# EAGLE design OSO-PYCO-A1-01 (EAGLE 9.6.2)
CHECKED: KTOWN; COMPANY: ADAFRUIT INDUSTRIES; DRAWN: KTOWN; REV: A

## Sheet 1 of 2
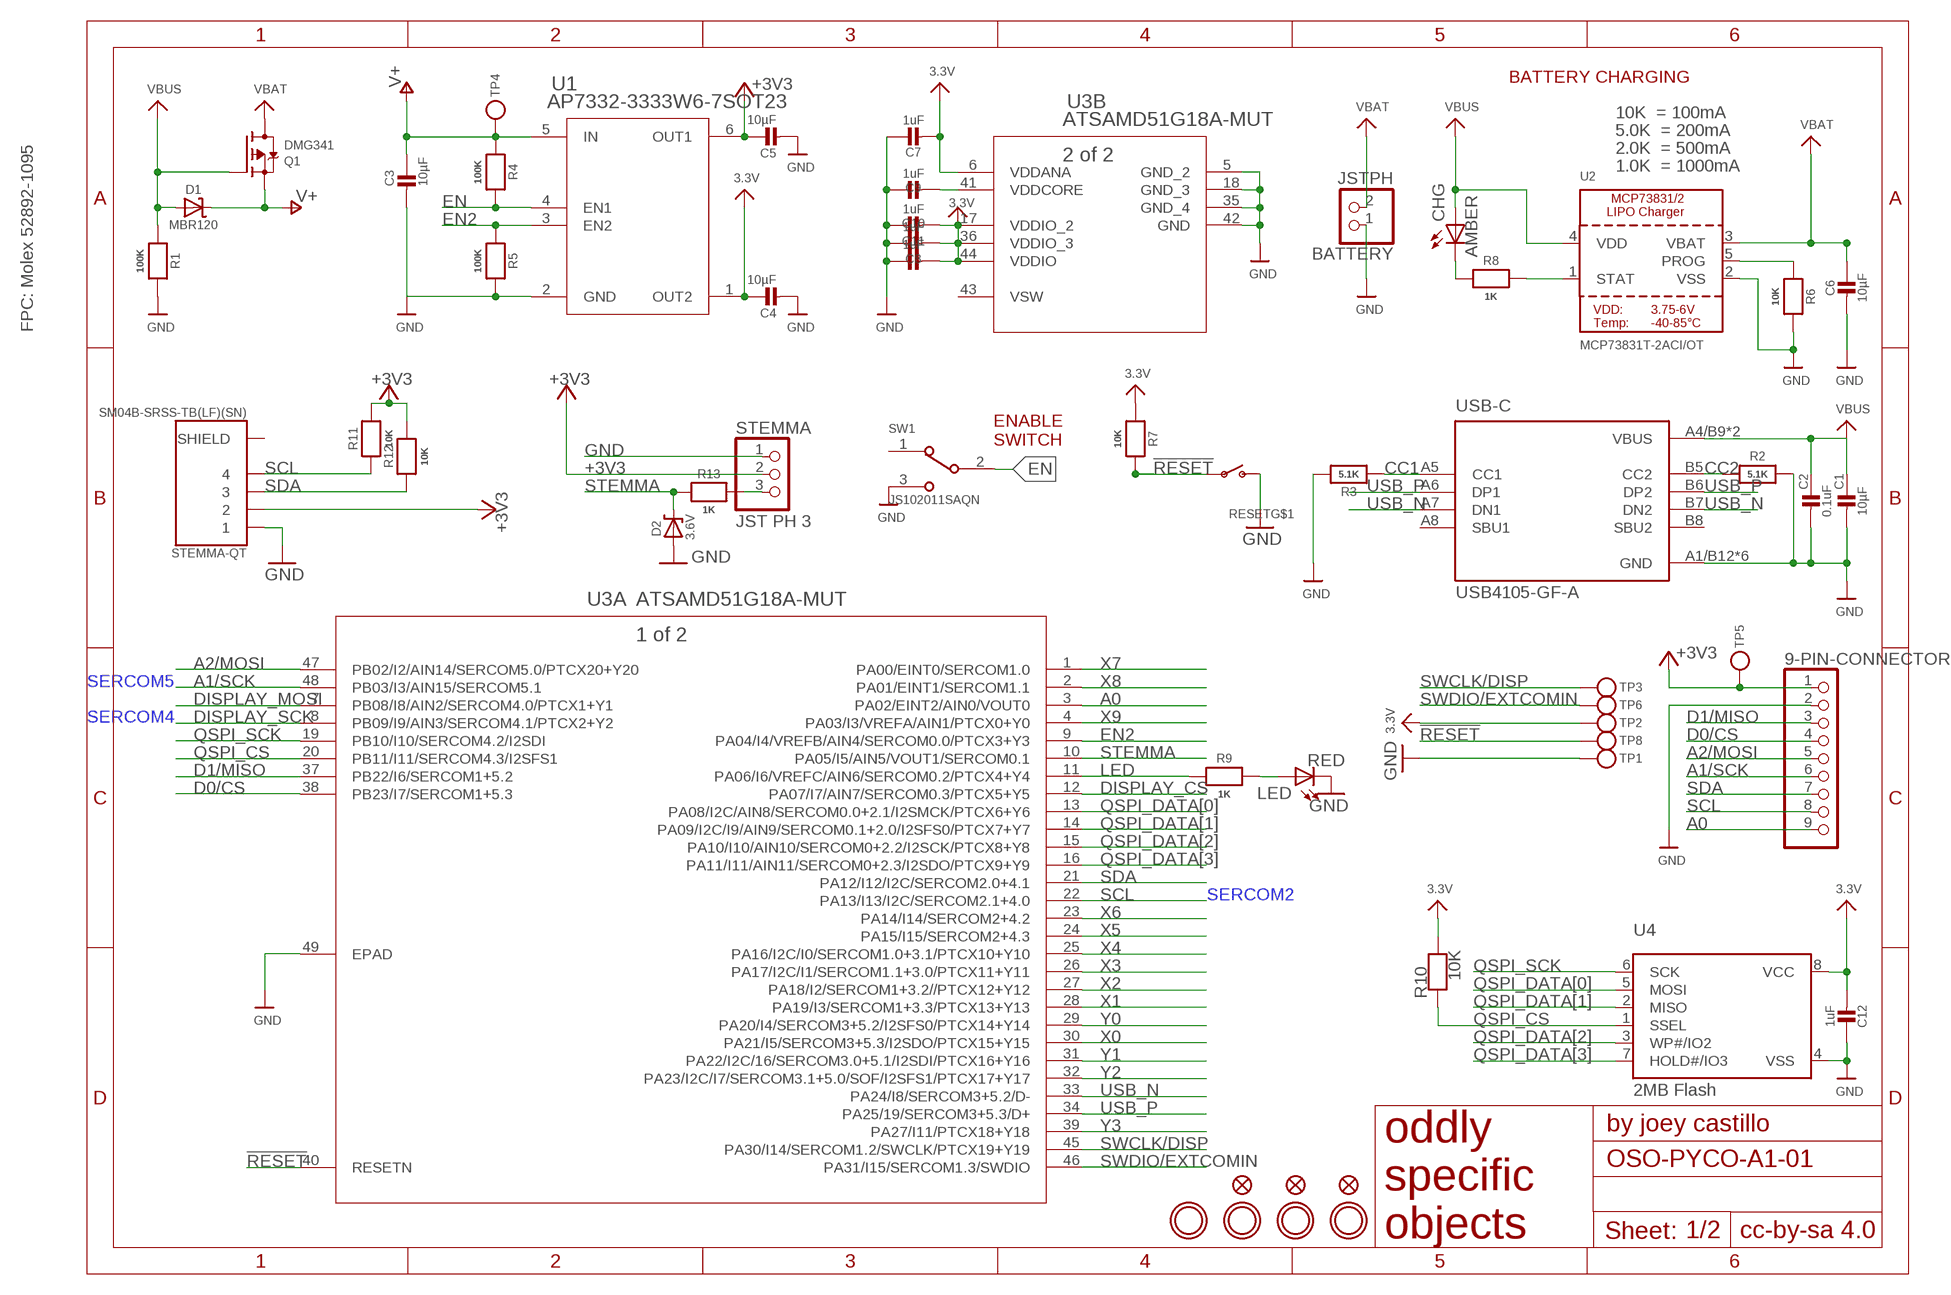
[diagram p0: schematic, sheet 1]

### Parts
9-PIN-CONNECTOR  HEADER-1X9_JSTSH  [JST_SH9]
BATTERY  JSTPH  CON_JST_PH_2PIN  [JSTPH2]
C1  10µF  CAP_CERAMIC0805-NOOUTLINE  [0805-NO]
C2  0.1uF  CAP_CERAMIC_0603MP  [_0603MP]
C3  10µF  CAP_CERAMIC0805-NOOUTLINE  [0805-NO]
C4  10µF  CAP_CERAMIC0805-NOOUTLINE  [0805-NO]
C5  10µF  CAP_CERAMIC0805-NOOUTLINE  [0805-NO]
C6  10µF  CAP_CERAMIC0805-NOOUTLINE  [0805-NO]
C7  1uF  CAP_CERAMIC_0603MP  [_0603MP]
C8  1uF  CAP_CERAMIC_0603MP  [_0603MP]
C9  1uF  CAP_CERAMIC_0603MP  [_0603MP]
C10  1uF  CAP_CERAMIC_0603MP  [_0603MP]
C11  1uF  CAP_CERAMIC_0603MP  [_0603MP]
C12  1uF  CAP_CERAMIC_0603MP  [_0603MP]
CHG  AMBER  LEDCHIP-LED0805  [CHIP-LED0805]
D1  MBR120  DIODE-SCHOTTKYSOD-123  [SOD-123]
D2  3.6V  DIODE-ZENERSOD123  [SOD-123]
FID1  FIDUCIAL_1MM  [FIDUCIAL_1MM]
FID2  FIDUCIAL_1MM  [FIDUCIAL_1MM]
FID3  FIDUCIAL_1MM  [FIDUCIAL_1MM]
LED  RED  LEDCHIP-LED0805  [CHIP-LED0805]
Q1  DMG341  MOSFET-P  [SOT23-R]
R1  100K  RESISTOR_0603MP  [_0603MP]
R2  5.1K  RESISTOR_0603MP  [_0603MP]
R3  5.1K  RESISTOR_0603MP  [_0603MP]
R4  100K  RESISTOR_0603MP  [_0603MP]
R5  100K  RESISTOR_0603MP  [_0603MP]
R6  10K  RESISTOR_0603MP  [_0603MP]
R7  10K  RESISTOR_0603MP  [_0603MP]
R8  1K  RESISTOR_0603MP  [_0603MP]
R9  1K  RESISTOR_0603MP  [_0603MP]
R10  10K  RESISTOR_0603MP  [_0603MP]
R11  10K  RESISTOR_0603MP  [_0603MP]
R12  10K  RESISTOR_0603MP  [_0603MP]
R13  1K  RESISTOR_0603MP  [_0603MP]
RESET  SWITCH_SPSTTL3330A  [TL3330A]
STEMMA  JST PH 3  CON_JST_PH_3PIN  [JSTPH3]
STEMMA-QT  SM04B-SRSS-TB(LF)(SN)  [JST_SM04B-SRSS-TB(LF)(SN)]
SW1  JS102011SAQN  [SW_JS102011SAQN]
TP1  TESTPOINTROUND2MMNO  [TESTPOINT_ROUND_2MM_NO]
TP2  TESTPOINTROUND2MMNO  [TESTPOINT_ROUND_2MM_NO]
TP3  TESTPOINTROUND2MMNO  [TESTPOINT_ROUND_2MM_NO]
TP4  TESTPOINTROUND2MMNO  [TESTPOINT_ROUND_2MM_NO]
TP5  TESTPOINTROUND2MMNO  [TESTPOINT_ROUND_2MM_NO]
TP6  TESTPOINTROUND2MMNO  [TESTPOINT_ROUND_2MM_NO]
TP8  TESTPOINTROUND2MMNO  [TESTPOINT_ROUND_2MM_NO]
U1  AP7332-3333W6-7SOT23  [SOT23-6]
U2  MCP73831T-2ACI/OT  MCP73831/2  [SOT23-5]
U3  ATSAMD51G18A-MUT  [QFN48_7X7MC]
U4  2MB Flash  SPIFLASH_SOIC8  [SOIC8_150MIL]
U$9  MOUNTINGHOLE2.5  [MOUNTINGHOLE_2.5_PLATED]
U$10  MOUNTINGHOLE2.5  [MOUNTINGHOLE_2.5_PLATED]
U$27  MOUNTINGHOLE2.5  [MOUNTINGHOLE_2.5_PLATED]
U$28  MOUNTINGHOLE2.5  [MOUNTINGHOLE_2.5_PLATED]
USB-C  USB4105-GF-A  [GCT_USB4105-GF-A]

### Nets
3.3V [power]: C4.1 C7.2 C8.2 C10.2 C11.2 C12.2 R7.1 R10.2 TP2.P$1 U1.1(OUT2) U3.6(B:VDDANA) U3.17(B:VDDIO_2) U3.36(B:VDDIO_3) U3.44(B:VDDIO) U4.8(VCC) ; also sheet 2
!RESET: R7.2 RESET.P$1(P) TP8.P$1 U3.40(A:RESETN)
+3V3 [power]: 9-PIN-CONNECTOR.1 C5.1 R11.2 R12.2 STEMMA-QT.2 STEMMA.2 TP5.P$1 U1.6(OUT1)
A0: 9-PIN-CONNECTOR.9 U3.3(A:PA02/EINT2/AIN0/VOUT0)
A1/SCK: 9-PIN-CONNECTOR.6 U3.48(A:PB03/I3/AIN15/SERCOM5.1)
A2/MOSI: 9-PIN-CONNECTOR.5 U3.47(A:PB02/I2/AIN14/SERCOM5.0/PTCX20+Y20)
CC1: R3.1 USB-C.A5(CC1)
CC2: R2.1 USB-C.B5(CC2)
D0/CS: 9-PIN-CONNECTOR.4 U3.38(A:PB23/I7/SERCOM1+5.3)
D1/MISO: 9-PIN-CONNECTOR.3 U3.37(A:PB22/I6/SERCOM1+5.2)
DISPLAY_CS: U3.12(A:PA07/I7/AIN7/SERCOM0.3/PTCX5+Y5) ; also sheet 2
DISPLAY_MOSI: U3.7(A:PB08/I8/AIN2/SERCOM4.0/PTCX1+Y1) ; also sheet 2
DISPLAY_SCK: U3.8(A:PB09/I9/AIN3/SERCOM4.1/PTCX2+Y2) ; also sheet 2
EN: R4.2 SW1.2 U1.4(EN1) ; also sheet 2
EN2: R5.1 U1.3(EN2) U3.9(A:PA04/I4/VREFB/AIN4/SERCOM0.0/PTCX3+Y3)
GND [gnd]: 9-PIN-CONNECTOR.2 BATTERY.1 C1.2 C2.2 C3.2 C4.2 C5.2 C6.2 C7.1 C8.1 C9.1 C10.1 C11.1 C12.1 D2.A LED.C R1.2 R2.2 R3.2 R5.2 R6.2 RESET.P$2(S) STEMMA-QT.1 STEMMA.1 SW1.3 TP1.P$1 U1.2(GND) U2.2(VSS) U3.5(B:GND_2) U3.18(B:GND_3) U3.35(B:GND_4) U3.42(B:GND) U3.49(A:EPAD) U4.4(VSS) USB-C.A1/B12(GND) USB-C.B1/A12(GND) USB-C.G1(GND) USB-C.G2(GND) USB-C.G3(GND) USB-C.G4(GND) ; also sheet 2
LED: R9.1 U3.11(A:PA06/I6/VREFC/AIN6/SERCOM0.2/PTCX4+Y4)
N$1: LED.A R9.2
N$2: CHG.C R8.1
PROG: R6.1 U2.5(PROG)
QSPI_CS: R10.1 U3.20(A:PB11/I11/SERCOM4.3/I2SFS1) U4.1(SSEL)
QSPI_DATA[0]: U3.13(A:PA08/I2C/AIN8/SERCOM0.0+2.1/I2SMCK/PTCX6+Y6) U4.5(MOSI)
QSPI_DATA[1]: U3.14(A:PA09/I2C/I9/AIN9/SERCOM0.1+2.0/I2SFS0/PTCX7+Y7) U4.2(MISO)
QSPI_DATA[2]: U3.15(A:PA10/I10/AIN10/SERCOM0+2.2/I2SCK/PTCX8+Y8) U4.3(WP#/IO2)
QSPI_DATA[3]: U3.16(A:PA11/I11/AIN11/SERCOM0+2.3/I2SDO/PTCX9+Y9) U4.7(HOLD#/IO3)
QSPI_SCK: U3.19(A:PB10/I10/SERCOM4.2/I2SDI) U4.6(SCK)
SCL: 9-PIN-CONNECTOR.8 R11.1 STEMMA-QT.4 U3.22(A:PA13/I13/I2C/SERCOM2.1+4.0)
SDA: 9-PIN-CONNECTOR.7 R12.1 STEMMA-QT.3 U3.21(A:PA12/I12/I2C/SERCOM2.0+4.1)
STAT: R8.2 U2.1(STAT)
STEMMA: D2.C R13.2 U3.10(A:PA05/I5/AIN5/VOUT1/SERCOM0.1)
STEMMA_: R13.1 STEMMA.3
SWCLK/DISP: TP3.P$1 U3.45(A:PA30/I14/SERCOM1.2/SWCLK/PTCX19+Y19) ; also sheet 2
SWDIO/EXTCOMIN: TP6.P$1 U3.46(A:PA31/I15/SERCOM1.3/SWDIO) ; also sheet 2
USB_N: U3.33(A:PA24/I8/SERCOM3+5.2/D-) USB-C.A7(DN1) USB-C.B7(DN2)
USB_P: U3.34(A:PA25/19/SERCOM3+5.3/D+) USB-C.A6(DP1) USB-C.B6(DP2)
V+ [power]: C3.1 D1.C Q1.2(S) R4.1 TP4.P$1 U1.5(IN) ; also sheet 2
VBAT [power]: BATTERY.2 C6.1 Q1.3(D) U2.3(VBAT)
VBUS [power]: C1.1 C2.1 CHG.A D1.A Q1.1(G) R1.1 U2.4(VDD) USB-C.A4/B9(VBUS) USB-C.B4/A9(VBUS)
VDDCORE1: C9.2 U3.41(B:VDDCORE)
X0: U3.30(A:PA21/I5/SERCOM3+5.3/I2SDO/PTCX15+Y15) ; also sheet 2
X1: U3.28(A:PA19/I3/SERCOM1+3.3/PTCX13+Y13) ; also sheet 2
X2: U3.27(A:PA18/I2/SERCOM1+3.2//PTCX12+Y12) ; also sheet 2
X3: U3.26(A:PA17/I2C/I1/SERCOM1.1+3.0/PTCX11+Y11) ; also sheet 2
X4: U3.25(A:PA16/I2C/I0/SERCOM1.0+3.1/PTCX10+Y10) ; also sheet 2
X5: U3.24(A:PA15/I15/SERCOM2+4.3) ; also sheet 2
X6: U3.23(A:PA14/I14/SERCOM2+4.2) ; also sheet 2
X7: U3.1(A:PA00/EINT0/SERCOM1.0) ; also sheet 2
X8: U3.2(A:PA01/EINT1/SERCOM1.1) ; also sheet 2
X9: U3.4(A:PA03/I3/VREFA/AIN1/PTCX0+Y0) ; also sheet 2
Y0: U3.29(A:PA20/I4/SERCOM3+5.2/I2SFS0/PTCX14+Y14) ; also sheet 2
Y1: U3.31(A:PA22/I2C/16/SERCOM3.0+5.1/I2SDI/PTCX16+Y16) ; also sheet 2
Y2: U3.32(A:PA23/I2C/I7/SERCOM3.1+5.0/SOF/I2SFS1/PTCX17+Y17) ; also sheet 2
Y3: U3.39(A:PA27/I11/PTCX18+Y18) ; also sheet 2
Unconnected: RESET.P$3(MT) RESET.P$4(MT) STEMMA-QT.S1(SHIELD) STEMMA-QT.S2(SHIELD) SW1.1 USB-C.A8(SBU1) USB-C.B8(SBU2)

### Notes on the sheet
- BATTERY CHARGING
- 10K  = 100mA
- 5.0K  = 200mA
- 2.0K  = 500mA
- 1.0K  = 1000mA
- FPC: Molex 52892-1095
- ENABLE
  SWITCH
- SERCOM5
- SERCOM4
- SERCOM2

## Sheet 2 of 2
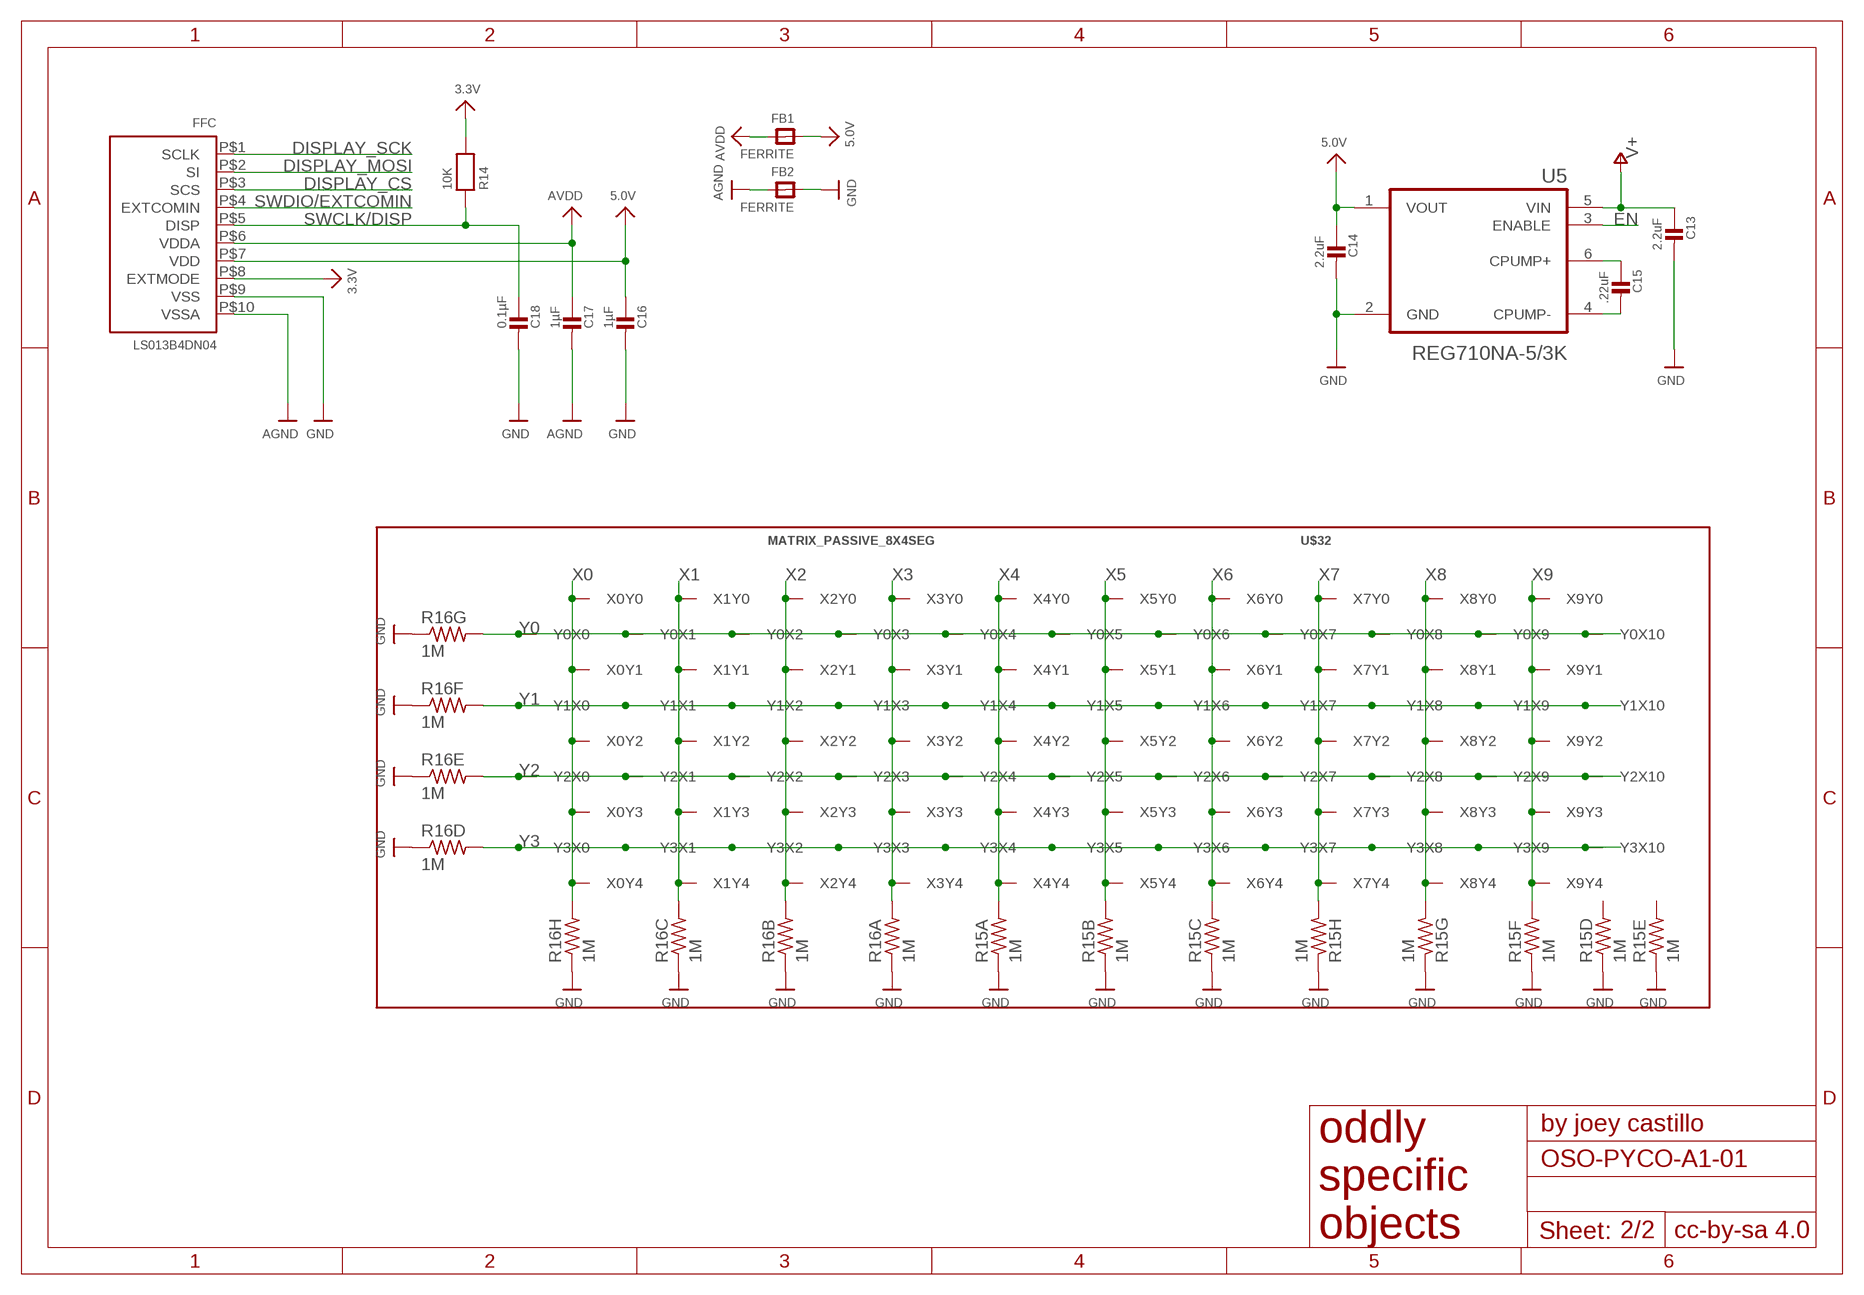
[diagram p1: schematic, sheet 2]

### Parts
C13  2.2uF  CAP_CERAMIC_0603MP  [_0603MP]
C14  2.2uF  CAP_CERAMIC_0603MP  [_0603MP]
C15  .22uF  CAP_CERAMIC_0603MP  [_0603MP]
C16  1µF  CAP_CERAMIC_0603MP  [_0603MP]
C17  1µF  CAP_CERAMIC_0603MP  [_0603MP]
C18  0.1µF  CAP_CERAMIC_0603MP  [_0603MP]
FB1  FERRITE  FERRITE_0805  [_0805]
FB2  FERRITE  FERRITE_0805  [_0805]
FFC  LS013B4DN04  DISP_EINK_SHARPMEMORYLCD_10PIN_27IN  [SHARP_2.7IN]
R14  10K  RESISTOR_0603MP  [_0603MP]
R15  1M  EXB-2HV470JV  [EXB2HV]
R16  1M  EXB-2HV470JV  [EXB2HV]
U5  REG710NA-5/3K  [SOT95P280X145-6N]
U$32  MATRIX_PASSIVE_8X4SEG  [MATRIX_ACTIVE_8X4SEG_4MM]

### Nets
3.3V [power]: FFC.P$8(EXTMODE) R14.2 ; also sheet 1
5.0V [power]: C14.1 C16.1 FB1.1 FFC.P$7(VDD) U5.1(VOUT)
AGND [gnd]: C17.2 FB2.2 FFC.P$10(VSSA)
AVDD [power]: C17.1 FB1.2 FFC.P$6(VDDA)
DISPLAY_CS: FFC.P$3(SCS) ; also sheet 1
DISPLAY_MOSI: FFC.P$2(SI) ; also sheet 1
DISPLAY_SCK: FFC.P$1(SCLK) ; also sheet 1
EN: U5.3(ENABLE) ; also sheet 1
GND [gnd]: C13.2 C14.2 C16.2 C18.2 FB2.1 FFC.P$9(VSS) R15.1 R15.2 R15.3 R15.4 R15.5 R15.6 R15.7 R15.8 R16.1 R16.2 R16.3 R16.4 R16.5 R16.6 R16.7 R16.8 U5.2(GND) ; also sheet 1
N$4: C15.1 U5.6(CPUMP+)
N$5: C15.2 U5.4(CPUMP-)
SWCLK/DISP: C18.1 FFC.P$5(DISP) R14.1 ; also sheet 1
SWDIO/EXTCOMIN: FFC.P$4(EXTCOMIN) ; also sheet 1
V+ [power]: C13.1 U5.5(VIN) ; also sheet 1
X0: R16.9 U$32.X0Y0 U$32.X0Y1 U$32.X0Y2 U$32.X0Y3 U$32.X0Y4 ; also sheet 1
X1: R16.14 U$32.X1Y0 U$32.X1Y1 U$32.X1Y2 U$32.X1Y3 U$32.X1Y4 ; also sheet 1
X2: R16.15 U$32.X2Y0 U$32.X2Y1 U$32.X2Y2 U$32.X2Y3 U$32.X2Y4 ; also sheet 1
X3: R16.16 U$32.X3Y0 U$32.X3Y1 U$32.X3Y2 U$32.X3Y3 U$32.X3Y4 ; also sheet 1
X4: R15.16 U$32.X4Y0 U$32.X4Y1 U$32.X4Y2 U$32.X4Y3 U$32.X4Y4 ; also sheet 1
X5: R15.15 U$32.X5Y0 U$32.X5Y1 U$32.X5Y2 U$32.X5Y3 U$32.X5Y4 ; also sheet 1
X6: R15.14 U$32.X6Y0 U$32.X6Y1 U$32.X6Y2 U$32.X6Y3 U$32.X6Y4 ; also sheet 1
X7: R15.9 U$32.X7Y0 U$32.X7Y1 U$32.X7Y2 U$32.X7Y3 U$32.X7Y4 ; also sheet 1
X8: R15.10 U$32.X8Y0 U$32.X8Y1 U$32.X8Y2 U$32.X8Y3 U$32.X8Y4 ; also sheet 1
X9: R15.11 U$32.X9Y0 U$32.X9Y1 U$32.X9Y2 U$32.X9Y3 U$32.X9Y4 ; also sheet 1
Y0: R16.10 U$32.Y0X0 U$32.Y0X1 U$32.Y0X2 U$32.Y0X3 U$32.Y0X4 U$32.Y0X5 U$32.Y0X6 U$32.Y0X7 U$32.Y0X8 U$32.Y0X9 U$32.Y0X10 ; also sheet 1
Y1: R16.11 U$32.Y1X0 U$32.Y1X1 U$32.Y1X2 U$32.Y1X3 U$32.Y1X4 U$32.Y1X5 U$32.Y1X6 U$32.Y1X7 U$32.Y1X8 U$32.Y1X9 U$32.Y1X10 ; also sheet 1
Y2: R16.12 U$32.Y2X0 U$32.Y2X1 U$32.Y2X2 U$32.Y2X3 U$32.Y2X4 U$32.Y2X5 U$32.Y2X6 U$32.Y2X7 U$32.Y2X8 U$32.Y2X9 U$32.Y2X10 ; also sheet 1
Y3: R16.13 U$32.Y3X0 U$32.Y3X1 U$32.Y3X2 U$32.Y3X3 U$32.Y3X4 U$32.Y3X5 U$32.Y3X6 U$32.Y3X7 U$32.Y3X8 U$32.Y3X9 U$32.Y3X10 ; also sheet 1
Unconnected: R15.12 R15.13

## Power pins joined to a net without a drawn wire
VSW: U3.43(B:VSW)

## Library data of the parts
9-PIN-CONNECTOR = microbuilder:HEADER-1X9: PIN HEADER
BATTERY = microbuilder:CON_JST_PH_2PIN: JST 2-Pin Right-Angle Connector PH-Series - 4UConnector: 17311 SH-Series - 4UConnector: 07278
C1 C2 C6-C12 C16-C18 = microbuilder:CAP_CERAMIC: Ceramic Capacitors For new designs, use the packages preceded by an '_' character since they are more reliable: The following footprints should be used on most boards: _0402 - Standard footprint for regular board layouts _0603 - Standard footprint for regular board layouts _0805 - Standard footprint for regular board layouts _1206 - Standard footprint for regular board layouts For extremely tight-pitch boards where space is at a premium, the following 'micro-pitch' footprints can be used (smaller pads, no silkscreen outline, etc.): _0402MP - Micro-pitch footprint for very dense/compact boards _0603MP - Micro-pitch footprint for very dense/compact boards _0805MP - Micro-pitch footprint for very dense/compact boards _1206MP - Micro-pitch footprint for very dense/compact boards
C3-C5 C13-C15 = microbuilder:CAP_CERAMIC: Ceramic Capacitors For new designs, use the packages preceded by an '_' character since they are more reliable: The following footprints should be used on most boards: _0402 - Standard footprint for regular board layouts _0603 - Standard footprint for regular board layouts _0805 - Standard footprint for regular board layouts _1206 - Standard footprint for regular board layouts For extremely tight-pitch boards where space is at a premium, the following 'micro-pitch' footprints can be used (smaller pads, no silkscreen outline, etc.): _0402MP - Micro-pitch footprint for very dense/compact boards _0603MP - Micro-pitch footprint for very dense/compact boards _0805MP - Micro-pitch footprint for very dense/compact boards _1206MP - Micro-pitch footprint for very dense/compact boards; REV: A
CHG LED = adafruit:LED: LED OSRAM: - CHIPLED LG R971, LG N971, LY N971, LG Q971, LY Q971, LO R971, LY R971 LH N974, LH R974 LS Q976, LO Q976, LY Q976 LO Q996 - Hyper CHIPLED LW Q18S LB Q993, LB Q99A, LB R99A - SideLED LS A670, LO A670, LY A670, LG A670, LP A670 LB A673, LV A673, LT A673, LW A673 LH A674 LY A675 LS A676, LA A676, LO A676, LY A676, LW A676 LS A679, LY A679, LG A679 - Hyper Micro SIDELED® LS Y876, LA Y876, LO Y876, LY Y876 LT Y87S - SmartLED LW L88C, LW L88S LB L89C, LB L89S, LG L890 LS L89K, LO L89K, LY L89K LS L896, LA L896, LO L896, LY L896 - TOPLED LS T670, LO T670, LY T670, LG T670, LP T670 LSG T670, LSP T670, LSY T670, LOP T670, LYG T670 LG T671, LOG T671, LSG T671 LB T673, LV T673, LT T673, LW T673 LH T674 LS T676, LA T676, LO T676, LY T676, LB T676, LH T676, LSB T676, LW T676 LB T67C, LV T67C, LT T67C, LS T67K, LO T67K, LY T67K, LW E67C LS E67B, LA E67B, LO E67B, LY E67B, LB E67C, LV E67C, LT E67C LW T67C LS T679, LY T679, LG T679 LS T770, LO T770, LY T770, LG T770, LP T770 LB T773, LV T773, LT T773, LW T773 LH T774 LS E675, LA E675, LY E675, LS T675 LS T776, LA T776, LO T776, LY T776, LB T776 LHGB T686 LT T68C, LB T68C - Hyper Mini TOPLED® LB M676 - Mini TOPLED Santana® LG M470 LS M47K, LO M47K, LY M47K Source: http://www.osram.convergy.de/
D1 = microbuilder:DIODE-SCHOTTKY
D2 = microbuilder:DIODE-ZENER: Zener Diode SMA: 30V 1W Zener Diode, 1.2Vf - Digikey: SMAZ30-FDICT-ND
FB1 FB2 = microbuilder:FERRITE: Ferrite Bead 0603 MMZ1608B121C - 120 Ohm @ 100MHz, 600mA, 0.15 Ohm DC Resistance - Digikey: 445-2164-1-ND BK1608HW121-T - 120 Ohm, 600mA Ferrite Chip - Digikey: 587-1876-2-ND 0805 HZ0805B272R-10 - 2.7K Ohm @ 100MHz, 200mA, 0.8 Ohm DC Resistance - Digikey: 240-2504-1-ND (see also Murata BLM21BD272SN1L) MMZ2012Y152B - 1.5K Ohm @ 100MHz, 500mA, 0.4 Ohm DC Resistance - Digikey: 445-1560-1-ND - Mainly for high frequency (80-400MHz) MMZ2012R102A - 1K Ohm @ 100MHz, 500mA, 0.3 Ohm DC Resistance - Digikey: 445-1555-2-ND - More general purpose (10-200MHz)
FFC = adafruit_display:DISP_EINK_SHARPMEMORYLCD_10PIN: Sharp Mono Memory LCD LS013B4DN04 - 1.35" 96x96 Pixels LS027B7DH01 - 2.7" 400x240 Pixels FPC Connector: Molex 52892-1095 (WM9203CT-ND)
FID1 FID2 = microbuilder:FIDUCIAL: Fiducial Alignment Points Various fiducial points for machine vision alignment.; BOM: EXCLUDE
FID3 = microbuilder:FIDUCIAL: Fiducial Alignment Points Various fiducial points for machine vision alignment.; BOM: EXCLUDE; REV: A
Q1 = microbuilder:MOSFET-P: P-Channel Mosfet LEGEND VDS: Voltage Drain-Source ID: Drain Current RDS(ON): Drain-Source On-State Resistance VGS(TH): Gate-Source Threshold Voltage CISS: Drain-Source Input Capacitance SOT-23 Name VDS ID RDS(ON) VGS(TH) CISS Order Number IRLML5103 30V 760mA 600 mOhm -- 75pF @ 25V Digikey: IRLML5103PBFCT-ND IRLML6401 12V 4.3A 50 mOhm 950mV @ 250µA 830pF @ 10V Digikey: IRLML6401PBFTR-ND NTR0202PL 20V 400mA 800 mOhm 2.3V @ 250uA 70pF @ 5V Digikey: NTR0202PLT1GOSTR-ND NTR4101PT1G 20V 1.8A 85 mOhm 1.2V @ 250uA 675pF @ 10V Digikey: NTR4101PT1GOSCT-ND DMP2004K 20V 600mA 900 mOhm 1V @ 250uA 175pF @ 16V Digikey: DMP2004KDICT-ND PMV65XP 20V 3.9A 76 mOhm 950mV @ 1mA 725pF @ 20V Digikey: 568-2358-2-ND TO-252 Name VDS ID RDS(ON) VGS(TH) CISS Order Number AOD417 30V 25A 34 mOhm 3V @ 250µA 920pF @ 15V Digikey: 785-1106-2-ND PowerPak Name VDS ID RDS(ON) VGS(TH) CISS Order Number AON7401 30V 12A 14 mOhm 3V @ 250µA 2600pF @ 15V Digikey: 785-1302-1-ND
R1-R14 = microbuilder:RESISTOR: Resistors For new designs, use the packages preceded by an '_' character since they are more reliable: The following footprints should be used on most boards: _0402 - Standard footprint for regular board layouts _0603 - Standard footprint for regular board layouts _0805 - Standard footprint for regular board layouts _1206 - Standard footprint for regular board layouts For extremely tight-pitch boards where space is at a premium, the following 'micro-pitch' footprints can be used (smaller pads, no silkscreen outline, etc.): _0402MP - Micro-pitch footprint for very dense/compact boards _0603MP - Micro-pitch footprint for very dense/compact boards _0805MP - Micro-pitch footprint for very dense/compact boards _1206MP - Micro-pitch footprint for very dense/compact boards
R15 R16 = EXB2HV470JV:EXB-2HV470JV; BUILT_BY: EMA_UL_Team; MANUFACTURER_PART_NUMBER: EXB-2HV470JV; VENDOR: Panasonic
RESET = oddlyspecific:SWITCH_SPST: Switch - SPST 4UCon 19192 (6.7x2.6mm SMT)
STEMMA = microbuilder:CON_JST_PH_3PIN
STEMMA-QT = SM04B-SRSS-TB_LF__SN_:SM04B-SRSS-TB(LF)(SN): SH Series 1.0 mm Pitch 2 Position Single Row Side Entry Shrouded Header; DESCRIPTION: SH Series 1.0 mm Pitch 2 Position Single Row Side Entry Shrouded Header; DIGI-KEY_PART_NUMBER: 455-1804-1-ND; DIGI-KEY_PURCHASE_URL: https://www.digikey.com/product-detail/en/jst-sales-america-inc/SM04B-SRSS-TB_LF__SN_/455-1804-1-ND/926875?utm_source=snapeda&utm_medium=aggregator&utm_campaign=symbol; MF: JST Sales; MP: SM04B-SRSS-TB_LF__SN_; PACKAGE: None
SW1 = JS102011SAQN:JS102011SAQN: JS10 Series SPDT On-On 6 V 0.3 A Gull Wing SMT Slide Switch http://www.snapeda.com/parts/JS102011SAQN/C%26K%20Components/view-part/; DESCRIPTION: Slide Switch SPDT Surface Mount, Right Angle; DIGI-KEY_PART_NUMBER: 401-1999-1-ND; DIGI-KEY_PURCHASE_URL: https://www.digikey.com/product-detail/en/c-k/JS102011SAQN/401-1999-1-ND/1640114?utm_source=snapeda&utm_medium=aggregator&utm_campaign=symbol; MF: C&K; MP: JS102011SAQN; PACKAGE: None
TP1-TP6 TP8 = microbuilder:TESTPOINT: Test Point Various test points for characterisation and PCB testing TESTPOINT_SMT - Compact Surface Mount Test Point [Digikey: 5016KTR-ND]
U1 = My Stuff:AP7332-3333W6-7
U2 = microbuilder:MCP73831/2: MCP73831/2 LIPO Charger VDD: 3.75 - 6V Temp -40 - 85°C Programmable Charge Rate: 15-500mA NOTE: STAT is a tri-state logic output on the MCP73831 and an open-drain output on the MCP73832. SOT23-5 with 4.2V output and tri-state logic on STAT = MCP73831T-2ACI/OT
U3 = ATSAMD51G18AMUT:ATSAMD51G18A-MUT; BUILT_BY: EMA_Molly; COPYRIGHT: Copyright (C) 2018 Accelerated Designs. All rights reserved; MANUFACTURER_PART_NUMBER: ATSAMD51G18A-MUT; VENDOR: Microchip
U4 = microbuilder:SPIFLASH_SOIC8: SOIC8 SPI Flash Be careful with the size since SOIC8 flash comes in several 'widths' SOIC8 150 mil M25P16 - 16Mbit (2Mbit x 8) Serial Flash (75MHz SPI Bus), Supply: 2.7-3.6V Digikey: SOIC8 - M25P16-VMN6P-ND SOIC8 208 mil W25Q16BVSSIG - 16Mbit (2Mbit x 8) Serial Flash (104MHz SPI Bus), Supply: 2.7-3.6V Digikey: SOIC8 - W25Q16BVSSIG-ND
U5 = REG710NA-5_3K:REG710NA-5/3K; DESCRIPTION: 30-mA Switched-Cap DC-DC Converter with fixed 5-V Output 6-SOT-23 -40 to 85; DIGI-KEY_PART_NUMBER: 296-26327-1-ND; MF: Texas Instruments; MP: REG710NA-5/3K; PACKAGE: SOT-23-6 Texas Instruments; PURCHASE-URL: https://pricing.snapeda.com/search/part/REG710NA-5/3K/?ref=eda
U$9 U$10 U$27 U$28 = microbuilder:MOUNTINGHOLE: Mounting Hole For #2 screws (0.086"/2.18mm width, 0.094"/2.4mm hole) use 2.5mm; BOM: EXCLUDE; REV: A
U$32 = My Stuff:MATRIX_PASSIVE_8X4SEG
USB-C = USB4105-GF-A:USB4105-GF-A: USB Type C Receptacle for USB 2.0 SMT Type, PCB Top Mount; DESCRIPTION: USB-C (USB TYPE-C) USB 2.0 Receptacle Connector 24 (16+8 Dummy) Position Surface Mount, Right Angle; Through Hole; MF: GCT; MP: USB4105-GF-A; PACKAGE: None; PURCHASE-URL: https://pricing.snapeda.com/search/part/USB4105-GF-A/?ref=eda

## Net classes
1 power: width 0.254 mm, drill 0.254 mm
2 gnd: width 0.254 mm, drill 0.254 mm

## Board
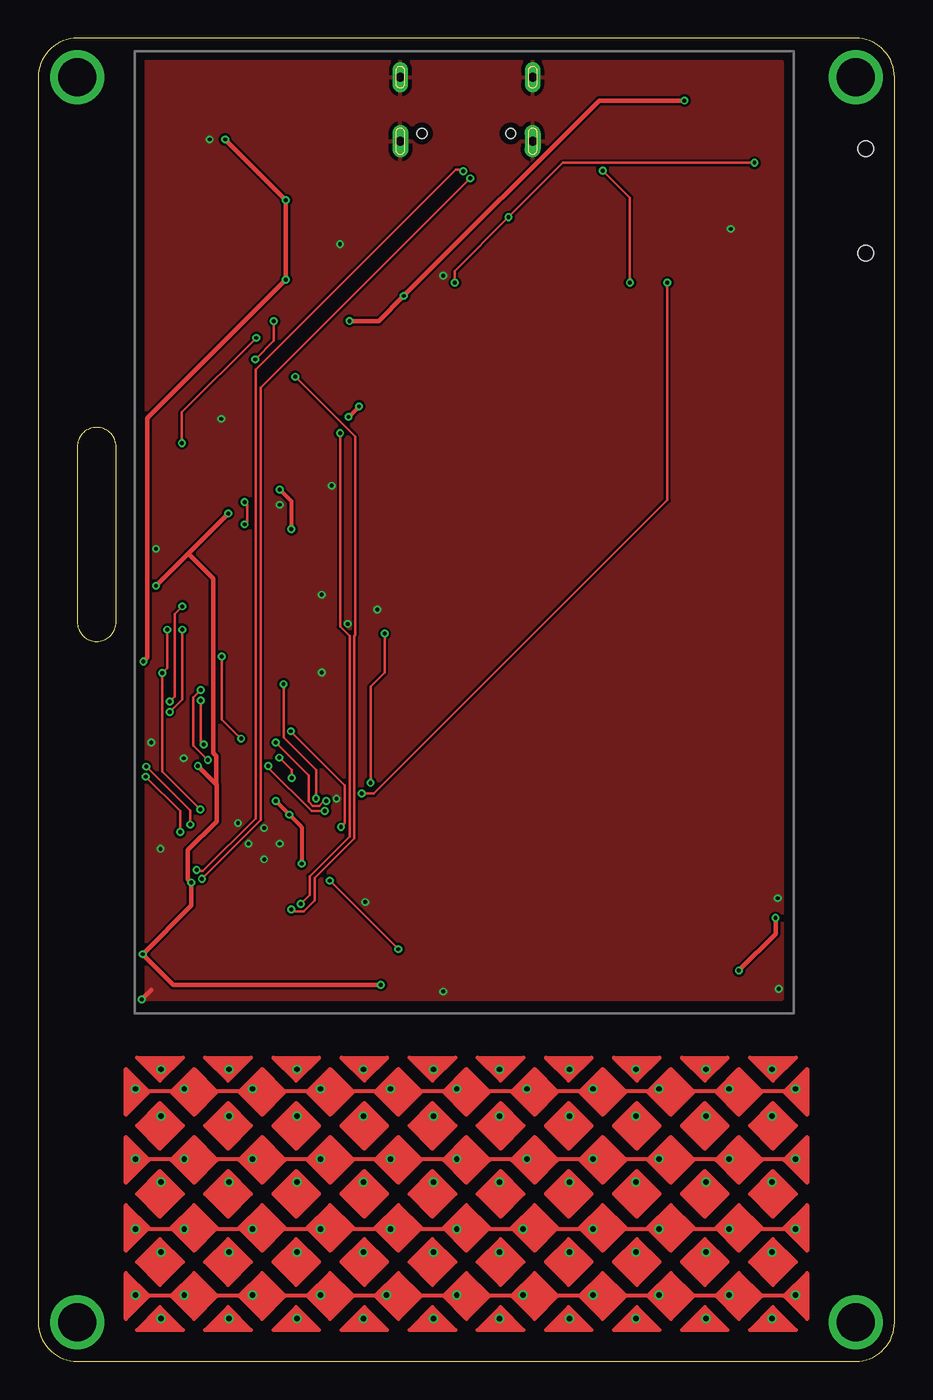
[diagram p2: board, top side]
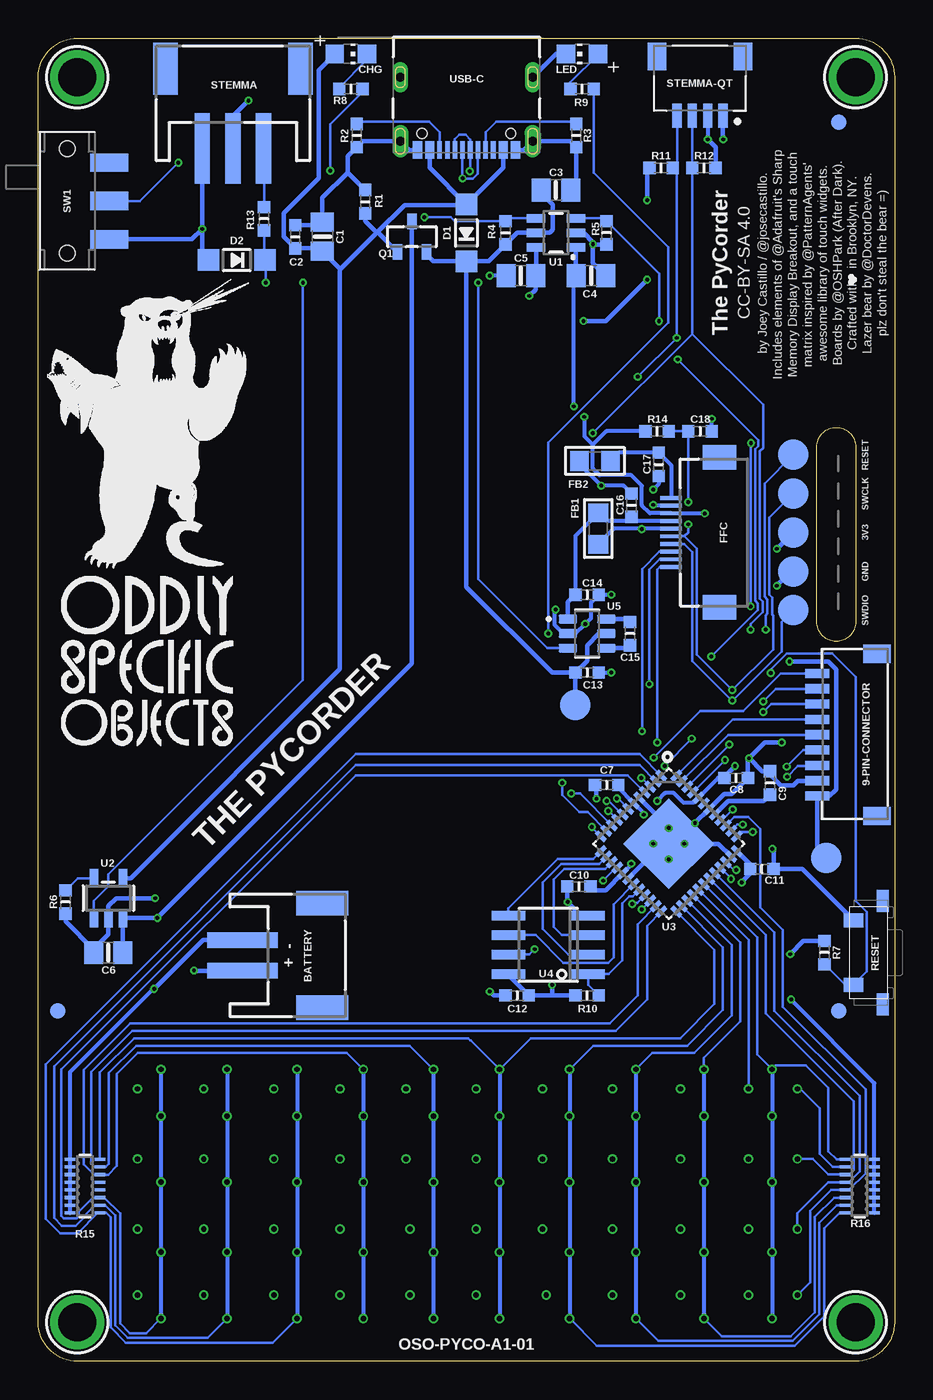
[diagram p3: board, bottom side, seen from below]

Size 55.88 x 86.36 mm. Coordinates in mm from the lower left corner, seen from the top.
Outline: 2.54,0 53.34,0 arc90 55.88,2.54 55.88,83.82 arc90 53.34,86.36 2.54,86.36 arc90 0,83.82 0,2.54 arc90 2.54,0
Outline: 5.08,59.69 arc90 3.81,60.96 arc90 2.54,59.69 2.54,48.26 arc90 3.81,46.99 arc90 5.08,48.26 5.08,59.69
Copper layers (1*16): Top 0.035559375mm / dielectric 1.6mm / Bottom 0.035559375mm
Design rules "oshpark-2layer *": minimum track width 6mil, minimum drill 10mil, track to track 6mil, track to pad 6mil, pad to pad 6mil, via to via 6mil, smd to smd 6mil, copper to edge 15mil, drill to drill 6mil, minimum pad ring 5mil, minimum via ring 5mil, stop-mask expansion 2.5mil, vias tented up to drill 12mil, thermal gap 10mil
bKeepout: area 24,32.7 to 54.5,69.7; area 26.2,35.5 to 51.2,68; area 26.6,33.8 to 50.6,68.8; area 28.1,33.1 to 48.1,69.1; area 5.1,0 to 50.8,21.6; area 29.9,43.9 to 55.3,70.6; area 24,32.2 to 54.5,43.6

### Footprints (pad centres in the part's own frame; a part is rotated, then mirrored left to right if it is on the bottom)
JST_SH9 = smd 0.6 x 1.55: 1 -4,2.514; 2 -3,2.514; 3 -2,2.514; 4 -1,2.514; 5 0,2.514; 6 1,2.514; 7 2,2.514; 8 3,2.514; 9 4,2.514 | smd 1.2 x 1.8: MT1 -5.3,-1.386; MT2 5.3,-1.386
JSTPH2 = smd 1 x 4.6: 1 -1,-3.7; 2 1,-3.7 | smd 1.6 x 3.4: NC1 -3.4,1.5; NC2 3.4,1.5
0805-NO = smd 1.24 x 1.5: 1 -0.95,0; 2 0.95,0
_0603MP = smd 0.8 x 0.8: 1 -0.762,0; 2 0.762,0
CHIP-LED0805 = smd 1.2 x 1.2: A 0,-1.05; C 0,1.05
SOD-123 = smd 1.4 x 1.4: A 1.85,0; C -1.85,0
_0805 = smd 1.2 x 1.3: 1 -1.016,0; 2 1.016,0
SHARP_2.7IN = smd 0.25 x 1.4: P$1 -2.25,2.9; P$2 -1.75,2.9; P$3 -1.25,2.9; P$4 -0.75,2.9; P$5 -0.25,2.9; P$6 0.25,2.9; P$7 0.75,2.9; P$8 1.25,2.9; P$9 1.75,2.9; P$10 2.25,2.9 | smd 1.6 x 2.2: SUPPORT1 -4.9,-0.25; SUPPORT2 4.9,-0.25
FIDUCIAL_1MM = smd 1 x 1: 1 0,0
SOT23-R = smd 0.635 x 1.016: 1 -0.95,-1; 2 0.95,-1; 3 0,1
EXB2HV = smd 0.686 x 0.203: 1 -0.965,1.75; 2 -0.965,1.25; 3 -0.965,0.75; 4 -0.965,0.25; 5 -0.965,-0.25; 6 -0.965,-0.75; 7 -0.965,-1.25; 8 -0.965,-1.75; 9 0.965,-1.75; 10 0.965,-1.25; 11 0.965,-0.75; 12 0.965,-0.25; 13 0.965,0.25; 14 0.965,0.75; 15 0.965,1.25; 16 0.965,1.75
TL3330A = smd 0.9 x 1.27: P$1 -2.1,0.89; P$2 2.1,0.89 | smd 1.45 x 0.8: P$3 -3.375,-1; P$4 3.375,-1
JSTPH3 = smd 1 x 4.6: 1 -2,-2.7; 2 0,-2.7; 3 2,-2.7 | smd 1.6 x 3.4: NC1 -4.4,2.5; NC2 4.4,2.5
JST_SM04B-SRSS-TB(LF)(SN) = smd 0.6 x 1.55: 1 -1.5,0; 2 -0.5,0; 3 0.5,0; 4 1.5,0 | smd 1.2 x 1.8: S1 -2.8,-3.875; S2 2.8,-3.875
SW_JS102011SAQN = smd 1.2 x 2.5: 1 -2.5,2.75; 2 0,2.75; 3 2.5,2.75 | hole 1: -3.4,0; 3.4,0
TESTPOINT_ROUND_2MM_NO = smd 2 x 2: P$1 0,0
SOT23-6 = smd 0.55 x 1.2: 1 0.95,1.3; 2 0,1.3; 3 -0.95,1.3; 4 -0.95,-1.3; 5 0,-1.3; 6 0.95,-1.3
SOT23-5 = smd 0.55 x 1.2: 1 -0.95,-1.3; 2 0,-1.3; 3 0.95,-1.3; 4 0.95,1.3; 5 -0.95,1.3
QFN48_7X7MC = smd 0.813 x 0.305: 1 -3.48,2.794; 2 -3.48,2.286; 3 -3.48,1.778; 4 -3.48,1.27; 5 -3.48,0.762; 6 -3.48,0.254; 7 -3.48,-0.254; 8 -3.48,-0.762; 9 -3.48,-1.27; 10 -3.48,-1.778; 11 -3.48,-2.286; 12 -3.48,-2.794; 25 3.48,-2.794; 26 3.48,-2.286; 27 3.48,-1.778; 28 3.48,-1.27; 29 3.48,-0.762; 30 3.48,-0.254; 31 3.48,0.254; 32 3.48,0.762; 33 3.48,1.27; 34 3.48,1.778; 35 3.48,2.286; 36 3.48,2.794 | smd 0.305 x 0.813: 13 -2.794,-3.48; 14 -2.286,-3.48; 15 -1.778,-3.48; 16 -1.27,-3.48; 17 -0.762,-3.48; 18 -0.254,-3.48; 19 0.254,-3.48; 20 0.762,-3.48; 21 1.27,-3.48; 22 1.778,-3.48; 23 2.286,-3.48; 24 2.794,-3.48; 37 2.794,3.48; 38 2.286,3.48; 39 1.778,3.48; 40 1.27,3.48; 41 0.762,3.48; 42 0.254,3.48; 43 -0.254,3.48; 44 -0.762,3.48; 45 -1.27,3.48; 46 -1.778,3.48; 47 -2.286,3.48; 48 -2.794,3.48 | smd 4.191 x 4.191: 49 0,0
SOIC8_150MIL = smd 0.6 x 2.2: 1 -1.905,-2.6; 2 -0.635,-2.6; 3 0.635,-2.6; 4 1.905,-2.6; 5 1.905,2.6; 6 0.635,2.6; 7 -0.635,2.6; 8 -1.905,2.6
SOT95P280X145-6N = smd 1.21 x 0.58: 1 -1.255,0.95; 2 -1.255,0; 3 -1.255,-0.95; 4 1.255,-0.95; 5 1.255,0; 6 1.255,0.95
MOUNTINGHOLE_2.5_PLATED = drill 2.5 pad 3.2: P$1 0,0
MATRIX_ACTIVE_8X4SEG_4MM = drill 0.356: X0Y0 -19.939,8.128; X0Y1 -19.939,5.08; X0Y2 -19.939,0.762; X0Y3 -19.939,-3.81; X0Y4 -19.939,-8.128; X1Y0 -15.494,8.128; X1Y1 -15.494,5.08; X1Y2 -15.494,0.762; X1Y3 -15.494,-3.81; X1Y4 -15.494,-8.128; X2Y0 -11.049,8.128; X2Y1 -11.049,5.08; X2Y2 -11.049,0.762; X2Y3 -11.049,-3.81; X2Y4 -11.049,-8.128; X3Y0 -6.731,8.128; X3Y1 -6.731,5.08; X3Y2 -6.731,0.762; X3Y3 -6.731,-3.81; X3Y4 -6.731,-8.128; X4Y0 -2.159,8.128; X4Y1 -2.159,5.08; X4Y2 -2.159,0.762; X4Y3 -2.159,-3.81; X4Y4 -2.159,-8.128; X5Y0 2.159,8.128; X5Y1 2.159,5.08; X5Y2 2.159,0.762; X5Y3 2.159,-3.81; X5Y4 2.159,-8.128; X6Y0 6.731,8.128; X6Y1 6.731,5.08; X6Y2 6.731,0.762; X6Y3 6.731,-3.81; X6Y4 6.731,-8.128; X7Y0 11.049,8.128; X7Y1 11.049,5.08; X7Y2 11.049,0.762; X7Y3 11.049,-3.81; X7Y4 11.049,-8.128; X8Y0 15.621,8.128; X8Y1 15.621,5.08; X8Y2 15.621,0.762; X8Y3 15.621,-3.81; X8Y4 15.621,-8.128; X9Y0 19.939,8.128; X9Y1 19.939,5.08; X9Y2 19.939,0.762; X9Y3 19.939,-3.81; X9Y4 19.939,-8.128; Y0X0 -21.59,6.858; Y0X1 -18.415,6.858; Y0X2 -13.97,6.858; Y0X3 -9.525,6.858; Y0X4 -4.953,6.858; Y0X5 -0.635,6.858; Y0X6 3.937,6.858; Y0X7 8.255,6.858; Y0X8 12.573,6.858; Y0X9 17.145,6.858; Y0X10 21.463,6.858; Y1X0 -21.59,2.286; Y1X1 -18.415,2.286; Y1X2 -13.97,2.286; Y1X3 -9.525,2.286; Y1X4 -4.953,2.286; Y1X5 -0.635,2.286; Y1X6 3.937,2.286; Y1X7 8.255,2.286; Y1X8 12.573,2.286; Y1X9 17.145,2.286; Y1X10 21.463,2.286; Y2X0 -21.59,-2.286; Y2X1 -18.415,-2.286; Y2X2 -13.97,-2.286; Y2X3 -9.525,-2.286; Y2X4 -4.953,-2.286; Y2X5 -0.635,-2.286; Y2X6 3.683,-2.286; Y2X7 8.255,-2.286; Y2X8 12.573,-2.286; Y2X9 17.145,-2.286; Y2X10 21.463,-2.286; Y3X0 -21.59,-6.604; Y3X1 -18.415,-6.604; Y3X2 -13.97,-6.604; Y3X3 -9.525,-6.604; Y3X4 -5.207,-6.604; Y3X5 -0.635,-6.604; Y3X6 3.683,-6.604; Y3X7 8.255,-6.604; Y3X8 12.573,-6.604; Y3X9 17.145,-6.604; Y3X10 21.463,-6.604
GCT_USB4105-GF-A = smd 0.6 x 1.15: A1/B12 -3.2,4.755; A4/B9 -2.4,4.755; B1/A12 3.2,4.755; B4/A9 2.4,4.755 | smd 0.3 x 1.15: A5 -1.25,4.755; A6 -0.25,4.755; A7 0.25,4.755; A8 1.25,4.755; B5 1.75,4.755; B6 0.75,4.755; B7 -0.75,4.755; B8 -1.75,4.755 | drill 0.6 pad 1 long: G1 -4.32,0; G2 4.32,0 | drill 0.6 pad 1.05 long: G3 -4.32,4.18; G4 4.32,4.18 | hole 0.65: 2.89,3.68; -2.89,3.68

### Placement (x,y rotation side)
9-PIN-CONNECTOR  2.54,40.89 90 bottom
BATTERY  38.86,26.49 270 bottom
C1  37.34,73.41 90 bottom
C2  39.12,73.41 90 bottom
C3  22.1,76.45 0 bottom
C4  19.81,70.87 0 bottom
C5  24.38,70.87 180 bottom
C6  51.31,26.67 180 bottom
C7  18.8,37.62 0 bottom
C8  10.34,38.07 180 bottom
C9  8.13,37.74 270 bottom
C10  20.6,30.99 0 bottom
C11  8.66,32.13 180 bottom
C12  24.64,23.88 0 bottom
C13  20.07,44.96 0 bottom
C14  20.07,50.04 0 bottom
C15  17.27,47.5 270 bottom
C16  17.17,55.88 90 bottom
C17  15.4,58.55 90 bottom
C18  12.7,60.71 0 bottom
CHG  35.48,85.34 270 bottom
D1  27.94,73.66 90 bottom
D2  42.93,71.88 180 bottom
FB1  19.33,54.36 270 bottom
FB2  19.56,58.77 0 bottom
FFC  11.68,54.1 90 bottom
FID1  3.63,22.86 0 bottom
FID2  54.61,22.86 0 bottom
FID3  3.63,80.87 0 bottom
LED  20.4,85.34 90 bottom
Q1  31.5,73.41 0 bottom
R1  34.54,75.69 90 bottom
R2  35.1,80.01 270 bottom
R3  20.78,80.01 270 bottom
R4  25.4,73.66 90 bottom
R5  18.8,73.66 270 bottom
R6  54.1,29.97 270 bottom
R7  4.57,26.67 270 bottom
R8  35.48,83.06 0 bottom
R9  20.4,83.06 180 bottom
R10  20.07,23.88 180 bottom
R11  15.24,77.9 180 bottom
R12  12.45,77.9 0 bottom
R13  41.15,74.57 270 bottom
R14  15.49,60.71 180 bottom
R15  52.83,11.43 0 bottom
R16  2.29,11.43 180 bottom
RESET  1.78,26.67 90 bottom
STEMMA  43.18,81.86 0 bottom
STEMMA-QT  12.7,81.31 180 bottom
SW1  54,75.74 270 bottom
TP1  6.6,54.1 90 bottom
TP2  6.6,51.56 90 bottom
TP3  6.6,56.64 90 bottom
TP4  20.83,42.82 0 bottom
TP5  4.47,32.87 0 bottom
TP6  6.6,49.02 90 bottom
TP8  6.6,59.18 90 bottom
U1  22.1,73.66 270 bottom
U2  51.31,30.23 0 bottom
U3  14.73,33.78 315 bottom
U4  22.61,27.18 90 bottom
U5  20.07,47.5 0 bottom
U$9  2.54,83.82 180 bottom
U$10  53.34,83.82 180 bottom
U$16  [OSO_WORDMARK_THREELINE_450MIL_1000DPI]  48.77,45.72 0 bottom
U$27  53.34,2.54 90 bottom
U$28  2.54,2.54 270 bottom
U$32  27.94,10.92 0 top
U$67  [OSO_BEAR_525X750MIL_1000DPI]  48.77,61.21 0 bottom
USB-C  27.94,83.82 180 bottom

### Tracks (layer width: path | path; a pad name or v marks a point on that pad's centre or on a via)
3.3V  (via drill 0.25)
  Top 0.254: v20.25,61.65 v20.93,62.33 | v17.19,32.48 17.19,34.87 v16.37,35.68 16.37,35.7 v15.49,36.58
  Top 0.305: v22.35,24.57 8.81,24.57 v6.81,26.57 9.98,29.75 v9.98,31.24 9.77,31.46 9.77,33.39 11.63,35.25 11.63,37.65 | v10.41,38.86 11.63,37.65 | 9.77,52.71 11.41,51.08 11.41,39.72 11.63,39.5 11.63,37.65 | v12.4,55.35 12.4,55.34 9.77,52.71 | 9.77,52.71 v7.68,50.62
  Bottom 0.254: C7.2 18.03,37.44 U3.6 16.37,35.78 v16.37,35.68 | C8.2 11.52,38.08 U3.44 13.14,36.45 13.77,36.45 14.4,37.08 14.99,37.08 v15.49,36.58 | v12.4,55.35 FFC.P$8 15.97,55.35 16.5,55.87 16.5,57.16 17.18,57.84 19.26,57.84 19.7,58.28 19.7,59.83 | v20.25,61.65 20.23,61.63 20.23,60.36 19.7,59.83 | v20.93,62.33 20.93,70.7 C4.1 | 19.7,59.83 19.48,60.05 19.47,60.05 18.82,60.71 R14.2 | C10.2 19.58,30.73 19.56,30.73 | U3.17 17.19,32.41 v17.19,32.48
  Bottom 0.305: U3.36 9.42,32.42 C11.2 9.42,31.86 9.88,31.4 9.88,31.34 v9.98,31.24 | 19.56,30.73 18.86,30.73 U3.17 | U1.1 20.8,70.9 C4.1 | U4.8 25.21,25.21 C12.2 22.35,23.88 | R7.1 5.95,27.43 v6.81,26.57 | 22.35,23.88 R10.2 | C8.2 11.1,38.18 v10.41,38.86 | v7.68,50.62 6.74,51.56 TP2.P$1 | v22.35,24.57 22.35,23.88
5.0V
  Bottom 0.254: FFC.P$7 17.02,54.85 | 17.02,54.85 18.81,54.85 FB1.1 20.83,53.88 C14.1 | C16.1 17.17,55.01 17.02,54.85
  Bottom 0.305: U5.1 21.32,49.55 C14.1
!RESET  (via drill 0.25)
  Top 0.152: v10.57,36.02 8.09,38.49 v8.09,44.92 8.42,45.25 v8.42,47.75
  Bottom 0.152: R7.2 3.23,24.57 RESET.P$1 1.8,25.43 1.8,29.31 2.54,30.05 2.54,44.66 4.06,46.19 7.05,46.19 8.09,45.15 v8.09,44.92 | U3.40 11.24,35.34 v10.57,36.02 | TP8.P$1 8.48,57.3 8.48,49.91 8.31,49.73 8.31,48.79 8.42,48.68 v8.42,47.75
+3V3  (via drill 0.25)
  Top 0.305: v42.16,82.3 36.62,82.3 23.86,69.55 v23.85,69.55 22.21,67.91 v20.31,67.91 | v6.86,45.68 7.11,45.93 7.11,61.57 v16.15,70.61 v16.15,75.79 v12.19,79.76
  Bottom 0.254: STEMMA-QT.2 v12.2,79.76 v12.19,79.76
  Bottom 0.305: U1.6 23.4,70.9 C5.1 23.43,69.96 v23.85,69.55 | v42.16,82.3 43.18,81.28 STEMMA.2 | R12.2 11.68,79.25 v12.2,79.76 | R11.2 16.15,77.75 v16.15,75.79 | v6.86,45.68 4.33,45.68 3.81,45.16 3.81,37.34 4.25,36.89 9-PIN-CONNECTOR.1 5.05,33.45 TP5.P$1 | v20.31,67.91 18.86,67.91 v16.15,70.61
A0  (via drill 0.25)
  Top 0.152: v16.54,38.08 16.54,38.58 v15.72,39.4
  Bottom 0.152: v16.54,38.08 16.51,38.08 U3.3 | 9-PIN-CONNECTOR.9 7.43,44.89 9.88,42.44 12.68,42.44 v15.72,39.4
A1/SCK
  Bottom 0.152: 9-PIN-CONNECTOR.6 10.57,41.89 U3.48
A2/MOSI
  Bottom 0.152: U3.47 13.89,37.88 10.87,40.89 9-PIN-CONNECTOR.5
AGND
  Bottom 0.254: FFC.P$10 14.58,58.5 C17.2 18.01,59.31 FB2.2
AVDD  (via drill 0.25)
  Top 0.254: v15.75,56.9 16.51,56.13 v16.51,54.32
  Bottom 0.254: FFC.P$6 16.51,54.35 | 16.51,54.35 18.32,54.35 FB1.2 | C17.1 15.4,57.25 v15.75,56.9 | v16.51,54.32 16.51,54.35
CC1
  Bottom 0.152: R3.1 20.92,80.92 26.01,80.92 26.69,80.24 USB-C.A5
CC2
  Bottom 0.152: R2.1 34.95,80.92 30.38,80.92 29.69,80.24 USB-C.B5
D0/CS  (via drill 0.25)
  Top 0.152: v7.04,38.81 9.91,35.95 v9.91,35.03
  Bottom 0.152: 9-PIN-CONNECTOR.4 5.96,39.89 v7.04,38.81 | U3.38 10.26,35.03 v9.91,35.03
D1/MISO  (via drill 0.25)
  Top 0.152: v9.26,34.54 9.26,35.91 v7.02,38.15
  Bottom 0.152: U3.37 10.02,34.54 v9.26,34.54 | v7.02,38.15 6.31,38.86 5.59,38.86 5.56,38.89 9-PIN-CONNECTOR.3
DISPLAY_CS  (via drill 0.25)
  Top 0.152: v19.76,34.87 20.01,35.13 20.01,37.6 v16.48,41.12
  Bottom 0.152: FFC.P$3 15.35,52.85 16.48,51.71 v16.48,41.12 | U3.12 19.76,34.85 v19.76,34.87
DISPLAY_MOSI  (via drill 0.25)
  Top 0.152: v18.12,36.74 18.12,38.6 16,40.72 v16,44.2
  Bottom 0.152: U3.7 18.05,36.74 v18.12,36.74 | FFC.P$2 15.34,52.35 16,51.69 v16,44.2
DISPLAY_SCK  (via drill 0.25)
  Top 0.152: v15.49,40.39 17.64,38.24 17.64,36.54 17.92,36.26 18.32,36.26 18.64,36.58 v18.8,36.58
  Bottom 0.152: U3.8 17.77,35.7 18.64,36.58 v18.8,36.58 | FFC.P$1 15.33,51.85 15.49,51.69 v15.49,40.39
EN  (via drill 0.25)
  Top 0.152: v46.74,78.23 34.24,78.23 v30.68,74.68 27.18,71.17 v27.18,70.41
  Bottom 0.152: U1.4 25.21,74.61 R4.2 28.7,74.42 28.96,74.68 v30.68,74.68 | SW1.2 49.25,75.74 46.76,78.23 v46.74,78.23 | U5.3 22.67,46.55 27.18,51.05 v27.18,70.41
EN2  (via drill 0.25)
  Top 0.152: v11.96,46 11.96,41.88 13.21,40.64 v13.23,40.64 | v15.37,67.89 15.37,66.62 v14.15,65.4 | v15.01,38.86 15.01,38.74 17.84,35.91 v18.7,35.91
  Bottom 0.152: U1.3 18.98,74.61 R5.1 15.37,71 v15.37,67.89 | U3.9 18.66,35.91 v18.7,35.91 | v13.23,40.64 v15.01,38.86 | v11.96,46 8.92,49.05 8.92,49.48 9.09,49.65 9.09,59.53 8.89,59.74 8.89,60.13 v14.15,65.4
GND  (via drill 0.25)
  Top 0.305: v6.76,23.62 7.37,24.23
  Bottom 0.254: R16.1 R16.2 R16.3 R16.4 R16.5 R16.6 R16.7 R16.8 1.32,18.15 6.76,23.58 v6.76,23.62 | R15.8 R15.7 R15.6 R15.5 R15.4 R15.3 R15.2 R15.1 53.8,18.87 48.37,24.3 v48.33,24.3 | FB2.1 20.57,58.57 v19.15,57.15 17.68,57.15 C16.2 | C18.2 v11.94,61.52 | FFC.P$9 15.67,55.85 15.72,55.91 v15.75,55.91 | C13.2 v18.49,44.96 | v18.49,50.04 C14.2 19.81,49.53 19.81,48.51 v20.19,48.13 20.83,47.5 U5.2 21.62,47.5 22.21,48.09 22.21,48.99 v22.12,49.07 | C5.2 v26.42,70.87
  Bottom 0.305: U3.35 11.5,33.78 v13.72,33.78 13.72,34.44 v13.03,35.13 U3.42 11.12,37.03 10.62,37.03 C8.1 9.58,39.29 v9.5,39.36 | U3.5 14.73,34.86 v14.73,34.8 U3.49 | v15.75,33.78 15.42,33.45 U3.18 | C12.1 26.16,23.88 v26.42,24.13 | U4.4 20.46,29.08 21.34,29.96 v21.34,29.97 21.36,30 C10.1 | C7.1 19.46,37.52 v19.46,36.72 | USB-C.A1/B12 24.2,79.06 USB-C.G3 21.17,79.64 R3.2 20.78,76.83 C3.2 | USB-C.B1/A12 31.69,79.06 USB-C.G4 34.71,79.64 R2.2 35.69,78.66 35.69,77.6 | BATTERY.1 45.13,27.49 v48.32,24.3 v48.33,24.3 | v48.26,30.23 50.8,30.23 51.31,29.72 U2.2 51.31,27.87 52.26,26.92 C6.2 52.26,26.86 54.1,28.7 R6.2 | R5.2 19.69,72.9 v19.69,72.92 | v19.69,72.92 19.69,73.06 20.29,73.66 U1.2 | STEMMA.1 v45.18,73.92 v45.19,73.91 | v45.19,73.91 45.19,72.29 D2.A | C2.2 37.53,74.17 C1.2 37.34,75.95 35.69,77.6 | v19.69,72.92 19.69,71.69 C4.2 | STEMMA-QT.1 11.2,79.78 v11.18,79.76 | R1.2 35.69,77.6 | v45.19,73.91 45.86,73.24 SW1.3 | TP1.P$1 6.61,54.1 v7.68,53.03 | RESET.P$2 6.03,32.13 C11.1 7.9,33.38 v7.98,33.45 | LED.C 22.1,85.34 USB-C.G1 | 9-PIN-CONNECTOR.2 6.31,37.89 6.61,37.59 7.43,37.59 8.13,38.3 C9.1 8.64,38.51 v9.5,39.36 | v7.37,40.39 8.48,40.39 v9.5,39.36
  other vias: 14.73,32.77
  pour Top: 7.06,84.84 48.51,84.84 48.51,23.62 7.06,23.62
LED  (via drill 0.25)
  Top 0.152: v22.61,47.5 22.61,44.96 21.68,44.03 v21.68,37.76
  Bottom 0.152: R9.1 19.63,77.57 14.78,72.72 14.78,67.79 22.61,59.97 v22.61,47.5 | U3.11 20.02,35.84 20.57,35.84 21.68,36.95 v21.68,37.76
N$1
  Bottom 0.152: LED.A 19.35,85.3 21.16,83.49 R9.2
N$2
  Bottom 0.152: CHG.C 34.43,84.95 36.25,83.13 R8.1
N$4
  Bottom 0.305: U5.6 17.46,48.45 C15.1
N$5
  Bottom 0.305: C15.2 17.46,46.55 U5.4
PROG
  Bottom 0.152: U2.5 53.31,31.53 R6.1
QSPI_CS
  Bottom 0.152: R10.1 20.01,24.58 U4.1 18.67,25.27 17.78,26.16 17.78,29.88 17.33,30.34 17.1,30.34 U3.20
QSPI_DATA[0]
  Bottom 0.152: U3.13 19.68,32.79 21.97,32.79 25.21,29.56 U4.5
QSPI_DATA[1]
  Bottom 0.152: U3.14 19.28,32.47 21.76,32.47 22.96,31.27 22.96,28.22 21.29,26.54 U4.2
QSPI_DATA[2]
  Bottom 0.152: U4.3 21.72,27.81 22.25,28.35 22.25,31.45 21.55,32.15 18.88,32.15 U3.15
QSPI_DATA[3]  (via drill 0.25)
  Top 0.152: v23.5,26.9 v19.03,31.37
  Bottom 0.152: U4.7 23.85,26.54 v23.5,26.9 | v19.03,31.37 18.17,32.22 U3.16
QSPI_SCK
  Bottom 0.152: U4.6 23.42,27.81 21.62,26.01 18.69,26.01 18.34,26.36 18.34,29.82 U3.19
SCL  (via drill 0.25)
  Top 0.152: v8.57,43.07 8.9,43.4 8.9,48.77 8.89,48.77 v9.4,49.28 | v14.22,66.8 9.37,61.95 v9.37,59.94 | v16.76,64.26 20.68,60.35 20.68,47.4 20.62,47.35 20.62,34.14 18.03,31.55 18.03,30.08 17.33,29.37 16.63,29.37 v16.51,29.49
  Bottom 0.152: 9-PIN-CONNECTOR.8 7.75,43.89 v8.57,43.07 | v16.51,29.49 U3.22 | STEMMA-QT.4 14.2,78.2 R11.1 14.22,77.65 v14.22,66.8 v16.76,64.26 | v9.4,49.28 9.4,59.91 v9.37,59.94
SDA  (via drill 0.25)
  Top 0.152: v9.4,47.75 9.4,43.2 v8.57,42.38 | v17.13,29.85 17.71,30.44 17.71,31.66 20.31,34.26 20.31,47.33 19.69,47.95 v19.69,60.59
  Bottom 0.152: 9-PIN-CONNECTOR.7 8.07,42.89 v8.57,42.38 | U3.21 16.8,29.91 17.07,29.91 v17.13,29.85 | v9.4,47.75 9.4,48.13 8.61,48.92 8.61,49.6 8.79,49.78 8.79,59.41 8.59,59.61 8.59,62.45 13.2,67.06 | STEMMA-QT.3 R12.1 | R12.1 | R12.1 13.2,67.06 | v19.69,60.59 13.21,67.06 13.2,67.06
STAT  (via drill 0.25)
  Top 0.152: v36.83,77.72 38.61,75.95 v38.61,70.41
  Bottom 0.152: U2.1 52.26,30.04 51.31,30.99 51.31,31.77 38.61,44.48 v38.61,70.41 | R8.2 34.66,83 34.66,82.91 36.83,80.75 v36.83,77.72
STEMMA  (via drill 0.25)
  Top 0.152: v21.11,37.06 21.9,37.06 41.05,56.21 v41.05,70.41
  Bottom 0.152: R13.2 41.15,71.95 D2.C 41.05,71.88 v41.05,70.41 | U3.10 20.52,37.06 v21.11,37.06
STEMMA_
  Bottom 0.152: R13.1 41.15,79.13 STEMMA.3
SWCLK/DISP  (via drill 0.25)
  Top 0.152: v10.59,43.81 10.11,43.33 10.11,40.2 v11.07,39.24 | v13.46,54.63 13.64,54.81 13.64,55.91 v13.46,56.08
  Bottom 0.152: FFC.P$5 13.72,53.85 | 13.72,53.85 12.9,53.03 12.9,46.13 v10.59,43.81 7.94,46.46 7.94,48.69 8,48.76 8,49.85 8.18,50.03 8.18,55.07 TP3.P$1 | R14.1 C18.1 v13.46,56.08 | v13.46,54.63 13.46,54.11 13.72,53.85 | U3.45 v11.07,39.24
SWDIO/EXTCOMIN  (via drill 0.25)
  Top 0.152: v10.59,43.13 10.59,40.47 v10.8,40.26
  Bottom 0.152: FFC.P$4 13.73,53.35 13.21,52.83 13.21,45.72 10.59,43.1 10.56,43.13 | v10.8,40.26 10.8,40.23 U3.46 | v10.59,43.13 10.56,43.13 | 10.56,43.13 7.37,46.32 7.37,48.26 TP6.P$1
USB_N  (via drill 0.25)
  Top 0.152: v10.68,31.49 14.53,35.34 14.53,63.55 v28.19,77.22
  Bottom 0.152: v10.68,31.49 10.68,31.52 U3.33 | USB-C.A7 28.21,79.05 28.21,77.23 v28.19,77.22 28.18,77.2 27.53,77.2 27.19,77.54 USB-C.B7
USB_P  (via drill 0.25)
  Top 0.152: v10.33,32.07 10.4,31.99 10.73,31.99 14.17,35.43 14.17,64.73 27.23,77.78 27.62,77.78 v27.73,77.68
  Bottom 0.152: v10.33,32.07 10.5,32.07 U3.34 | v27.73,77.68 27.69,77.72 USB-C.A6 27.69,79.76 27.99,80.06 28.4,80.06 28.69,79.77 USB-C.B6
V+
  Bottom 0.305: Q1.2 30.55,72.25 30.11,71.81 D1.C | D1.C 26.49,71.81 R4.1 24.64,73.66 U1.5 22.49,73.66 22.29,73.86 22.29,75.51 23.05,76.26 C3.1 | D1.C 27.94,50.55 22.35,44.96 C13.1 | U5.5 19.3,47.5 20.07,46.74 20.07,45.72 C13.1 | TP4.P$1 C13.1
VBAT  (via drill 0.25)
  Top 0.305: v45.72,25.5 48.11,27.89 v48.11,28.93
  Bottom 0.305: BATTERY.2 v45.71,25.49 v45.72,25.5 | C6.1 U2.3 v48.11,28.93 31.5,45.54 Q1.3
VBUS
  Bottom 0.305: USB-C.B4/A9 30.34,77.91 D1.A | USB-C.A4/B9 25.54,77.91 D1.A | D1.A 27.98,75.47 31.97,75.47 33.78,73.66 | 33.78,73.66 36.2,71.25 | 36.2,71.25 36.2,45.18 49.85,31.53 U2.4 | CHG.A 37.59,84.29 37.59,77.22 39.88,74.93 39.88,73.41 C2.1 37.53,72.64 C1.1 36.2,71.31 36.2,71.25 | Q1.1 33.7,73.66 33.78,73.66 | R1.1 34.54,74.42 33.78,73.66
VDDCORE1
  Bottom 0.305: U3.41 10.86,36.58 8.53,36.58 C9.2
X0
  Bottom 0.152: R16.9 3.78,13.18 4.32,13.72 4.32,17.83 5.79,19.3 7.75,19.3 U$32.X0Y0 8.97,20.02 8.97,27.66 U3.30
  Bottom 0.254: U$32.X0Y0 U$32.X0Y1 U$32.X0Y2 U$32.X0Y3 U$32.X0Y4
X1
  Bottom 0.152: U$32.X1Y4 11.28,1.63 6.77,1.63 5.21,3.19 5.21,9.42 3.95,10.68 R16.14 | U$32.X1Y0 12.45,19.81 10.08,22.17 10.08,27.34 U3.28
  Bottom 0.254: U$32.X1Y0 U$32.X1Y1 U$32.X1Y2 U$32.X1Y3 U$32.X1Y4
X2
  Bottom 0.152: 16.76,2.67 15.42,1.32 6.64,1.32 4.9,3.06 4.9,9.04 3.76,10.18 R16.15 | U$32.X2Y0 15.82,20.12 13.08,20.12 10.63,22.57 10.63,27.16 U3.27
  Bottom 0.254: U$32.X2Y0 U$32.X2Y1 U$32.X2Y2 U$32.X2Y3 U$32.X2Y4 16.76,2.67
X3
  Bottom 0.152: U$32.X3Y4 19.43,1.02 6.52,1.02 4.6,2.93 4.6,8.66 3.58,9.68 R16.16 | U$32.X3Y0 19.66,20.6 13.54,20.6 11.2,22.93 11.2,27.02 U3.26
  Bottom 0.254: U$32.X3Y0 U$32.X3Y1 U$32.X3Y2 U$32.X3Y3 U$32.X3Y4
X4
  Bottom 0.152: R15.16 51.87,18.84 49.63,21.08 27.84,21.08 27.69,20.93 27.66,20.93 U$32.X4Y0 23.75,21.08 13.99,21.08 11.76,23.32 11.76,26.86 U3.25
  Bottom 0.254: U$32.X4Y0 U$32.X4Y1 U$32.X4Y2 U$32.X4Y3 U$32.X4Y4
X5
  Bottom 0.152: U$32.X5Y0 31.65,20.6 49.5,20.6 51.28,18.82 51.28,12.88 51.48,12.68 R15.15 52.24,12.68 52.44,12.88 52.44,18.88 49.76,21.57 18.21,21.57 16.15,23.62 16.15,28.41 U3.24
  Bottom 0.254: U$32.X5Y0 U$32.X5Y1 U$32.X5Y2 U$32.X5Y3 U$32.X5Y4
X6
  Bottom 0.152: U$32.X6Y0 35.74,20.12 49.38,20.12 50.75,18.75 50.75,12.75 51.32,12.18 R15.14 52.24,12.18 52.92,12.86 52.92,19.01 49.88,22.05 18.59,22.05 16.76,23.88 16.76,28.52 U3.23
  Bottom 0.254: U$32.X6Y0 U$32.X6Y1 U$32.X6Y2 U$32.X6Y3 U$32.X6Y4
X7
  Bottom 0.152: U$32.X7Y4 39.06,2.73 40.57,1.22 50.16,1.22 51.16,2.21 51.16,9.4 51.44,9.68 R15.9 51.99,9.68 53.31,8.36 54.46,8.36 55.39,9.28 55.39,19.39 35.15,39.62 16.62,39.62 U3.1
  Bottom 0.254: U$32.X7Y0 U$32.X7Y1 U$32.X7Y2 U$32.X7Y3 38.99,2.8 39.06,2.73
X8
  Bottom 0.152: U$32.X8Y4 44.83,1.52 50.04,1.52 50.85,2.34 50.85,9.53 51.51,10.18 R15.10 52.19,10.18 52.92,9.44 52.92,9.36 53.44,8.84 54.34,8.84 54.85,9.36 54.85,19.24 35.18,38.91 16.63,38.91 U3.2
  Bottom 0.254: U$32.X8Y0 U$32.X8Y1 U$32.X8Y2 U$32.X8Y3 U$32.X8Y4
X9
  Bottom 0.152: U$32.X9Y4 48.84,1.83 49.91,1.83 50.55,2.46 50.55,9.65 51.57,10.68 R15.11 52.31,10.68 53.23,9.77 53.23,9.48 53.39,9.32 54.21,9.32 54.37,9.48 54.37,19.04 35.15,38.25 17.41,38.25 U3.4
  Bottom 0.254: U$32.X9Y0 U$32.X9Y1 U$32.X9Y2 U$32.X9Y3 U$32.X9Y4
Y0
  Top 0.152: 36.07,17.65 U$32.Y0X7 | 31.75,17.65 U$32.Y0X6 | U$32.Y0X5 27.43,17.65 | 22.86,17.65 U$32.Y0X4 | 13.84,17.65 U$32.Y0X2
  Top 0.254: U$32.Y0X0 6.48,17.65 9.65,17.65 | U$32.Y0X1 9.65,17.65 | 9.65,17.65 13.84,17.65 | U$32.Y0X2 14.1,17.65 18.54,17.65 | U$32.Y0X3 18.54,17.65 | 18.54,17.65 22.86,17.65 | U$32.Y0X4 23.11,17.65 27.18,17.65 U$32.Y0X5 | 27.43,17.65 31.75,17.65 | U$32.Y0X6 32,17.65 36.07,17.65 | U$32.Y0X7 36.32,17.65 40.39,17.65 U$32.Y0X8 40.64,17.65 44.96,17.65 U$32.Y0X9 45.21,17.65 49.28,17.65 U$32.Y0X10
  Bottom 0.152: U$32.Y0X0 6.15,17.78 4.88,16.51 4.88,13.54 4.03,12.69 R16.10 | U3.29 9.53,27.5 U$32.Y0X1
Y1
  Top 0.254: U$32.Y1X0 U$32.Y1X1 U$32.Y1X2 U$32.Y1X3 U$32.Y1X4 U$32.Y1X5 U$32.Y1X6 U$32.Y1X7 U$32.Y1X8 U$32.Y1X9 | U$32.Y1X9 45.59,13.21 45.72,13.08 45.21,13.08 U$32.Y1X9 | U$32.Y1X9 U$32.Y1X10
  Bottom 0.152: U$32.Y1X0 5.33,13.21 4.32,12.19 3.26,12.19 R16.11 2.98,12.18 2.68,12.48 2.68,16.98 8.41,22.71 8.41,27.82 U3.31
Y2
  Top 0.254: U$32.Y2X0 U$32.Y2X1 U$32.Y2X2 U$32.Y2X3 U$32.Y2X4 U$32.Y2X5 U$32.Y2X6 U$32.Y2X7 U$32.Y2X8 U$32.Y2X9 U$32.Y2X10
  Bottom 0.152: U$32.Y2X0 6.35,9.65 4.32,11.68 R16.12 2.98,11.68 2.27,12.39 2.27,17.31 7.85,22.88 7.85,27.98 U3.32
Y3
  Top 0.254: U$32.Y3X0 U$32.Y3X1 U$32.Y3X2 U$32.Y3X3 U$32.Y3X4 U$32.Y3X5 U$32.Y3X6 U$32.Y3X7 U$32.Y3X8 U$32.Y3X9 U$32.Y3X10
  Bottom 0.152: U$32.Y3X0 5.51,5.16 5.51,9.8 4.13,11.18 R16.13 2.98,11.18 1.89,12.27 1.89,17.74 7.29,23.14 7.29,28.14 8.77,29.63 8.77,34.76 9.54,35.53 10.47,35.53 U3.39

### Text on the board
bPlace: by Joey Castillo / @josecastillo. / Includes elements of @Adafruit's Sharp / Memory Display Breakout, and a touch / matrix inspired by @PatternAgents' / awesome library of touch widgets. / Boards by @OSHPark (After Dark). / Crafted with in Brooklyn, NY. / Lazer bear by @DoctorDevens. / plz don't steal the bear =) | CC-BY-SA 4.0 | The PyCorder | RESET | SWCLK | 3V3 | GND | SWDIO | THE PYCORDER | + - | OSO-PYCO-A1-01